# Altium schematic sheet BMW F800GS Board.SchDoc
size A4
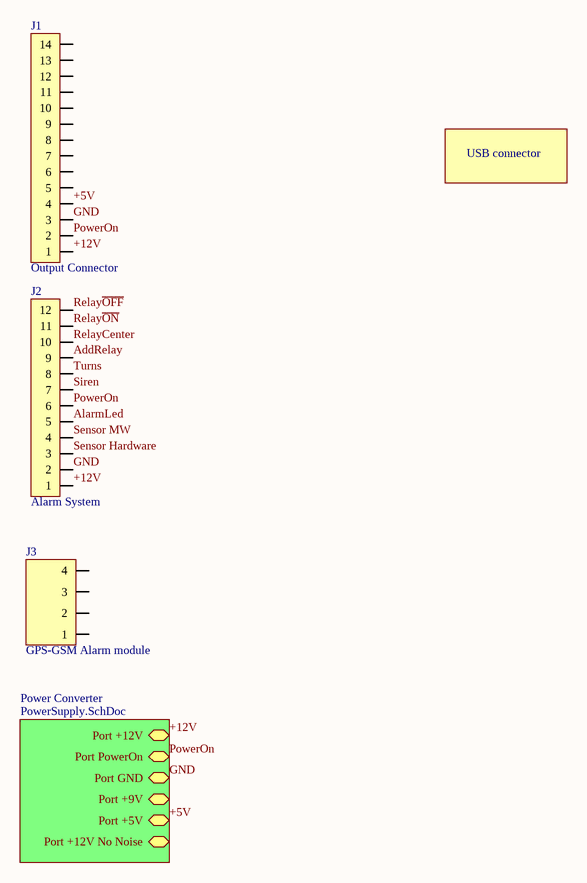
[diagram p0: BMW F800GS Board.SchDoc]

## Parts
J1  Output Connector  [Molex Micro-Fit 3.0 - 14 pin D R]
J2  Alarm System  [Molex Micro-Fit 3.0 - 12 pin D R]
J3  GPS-GSM Alarm module  [Line 2.54 X 4]

## Sub-sheets
Power Converter = PowerSupply.SchDoc: Port +12V (bidir), Port GND (bidir), Port +9V (bidir), Port +5V (bidir), Port +12V No Noise, Port PowerOn

## Nets
+5V: J1.4 ; sheet Power Converter/Port +5V
+12V: J1.1 J2.1 ; sheet Power Converter/Port +12V
AddRelay: J2.9
AlarmLed: J2.5
GND: J1.3 J2.2 ; sheet Power Converter/Port GND
PowerOn: J1.2 J2.6 ; sheet Power Converter/Port PowerOn
RelayCenter: J2.10
Relay~{OFF}: J2.12
Relay~{ON}: J2.11
Sensor Hardware: J2.3
Sensor MW: J2.4
Siren: J2.7
Turns: J2.8

Not connected (* = marked no-connect by the designer): J1 5 6 7 8 9 10 11 12 13 14; J3 1 2 3 4

## Notes on the sheet
- USB connector

## Library data of the parts
J1 = Micro-Fit 14 (2x7): Horisontal, Dbl line, Male
J2 = Micro-Fit 12 (2x6): Horisontal, Dbl line, Male
J3 = PLS-4: Vert, Sgl line, Male